# Altium schematic sheet Thermo.SchDoc
size A4
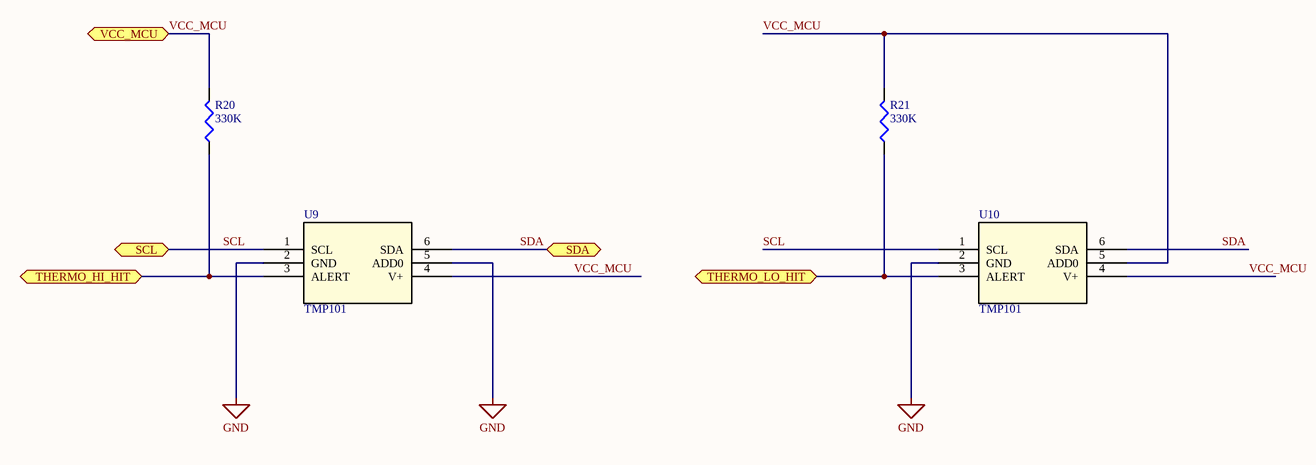
[diagram p0: Thermo.SchDoc]

## Parts
R20  value 330K  [0603]  (hidden comment: Res3)
R21  value 330K  [0603]  (hidden comment: Res3)
U9  TMP101  [SOT23-6]
U10  TMP101  [SOT23-6]

## Ports
SCL (bidir), SDA (bidir), THERMO_HI_HIT (bidir), THERMO_LO_HIT (bidir), VCC_MCU (bidir)

## Nets
GND: U9.2(GND) U9.5(ADD0) U10.2(GND)
SCL: U9.1(SCL) U10.1(SCL) ; port SCL
SDA: U9.6(SDA) U10.6(SDA) ; port SDA
THERMO_HI_HIT: R20.1 U9.3(ALERT) ; port THERMO_HI_HIT
THERMO_LO_HIT: R21.1 U10.3(ALERT) ; port THERMO_LO_HIT
VCC_MCU: R20.2 R21.2 U9.4(V+) U10.4(V+) U10.5(ADD0) ; port VCC_MCU

## Library data of the parts
R20 R21 = Res3: Resistor; Published: 8-Jun-2000; LatestRevisionDate: 29-May-2009; LatestRevisionNote: IPC-7351 Footprint Added.; PackageReference: J1-0603; Publisher: Altium Limited; PackageDescription: Chip Resistor
U9 U10 = TMP101: Imported; Manufacturer_Part_Number: tmp101_dbv_6; Vendor: Texas Instruments; PACKAGE_DESIGNATOR: DBV; PIN_COUNT: 6; FAMILY_NAME: TEMPERATURE SENSOR; INDUSTRY_STD_PKG_TYPE: SOT-23; GENERIC_PART_NUMBER: TMP101; Datasheet URL: http://www.ti.com/lit/gpn/TMP101; Manufacturer: Texas Instruments; RefDes: RefDes; Type: DEV